# Altium schematic sheet [11] Power Input and Regualtor.SchDoc
size A; DocumentNumber: 11; SheetNumber: 11; SheetTotal: 11
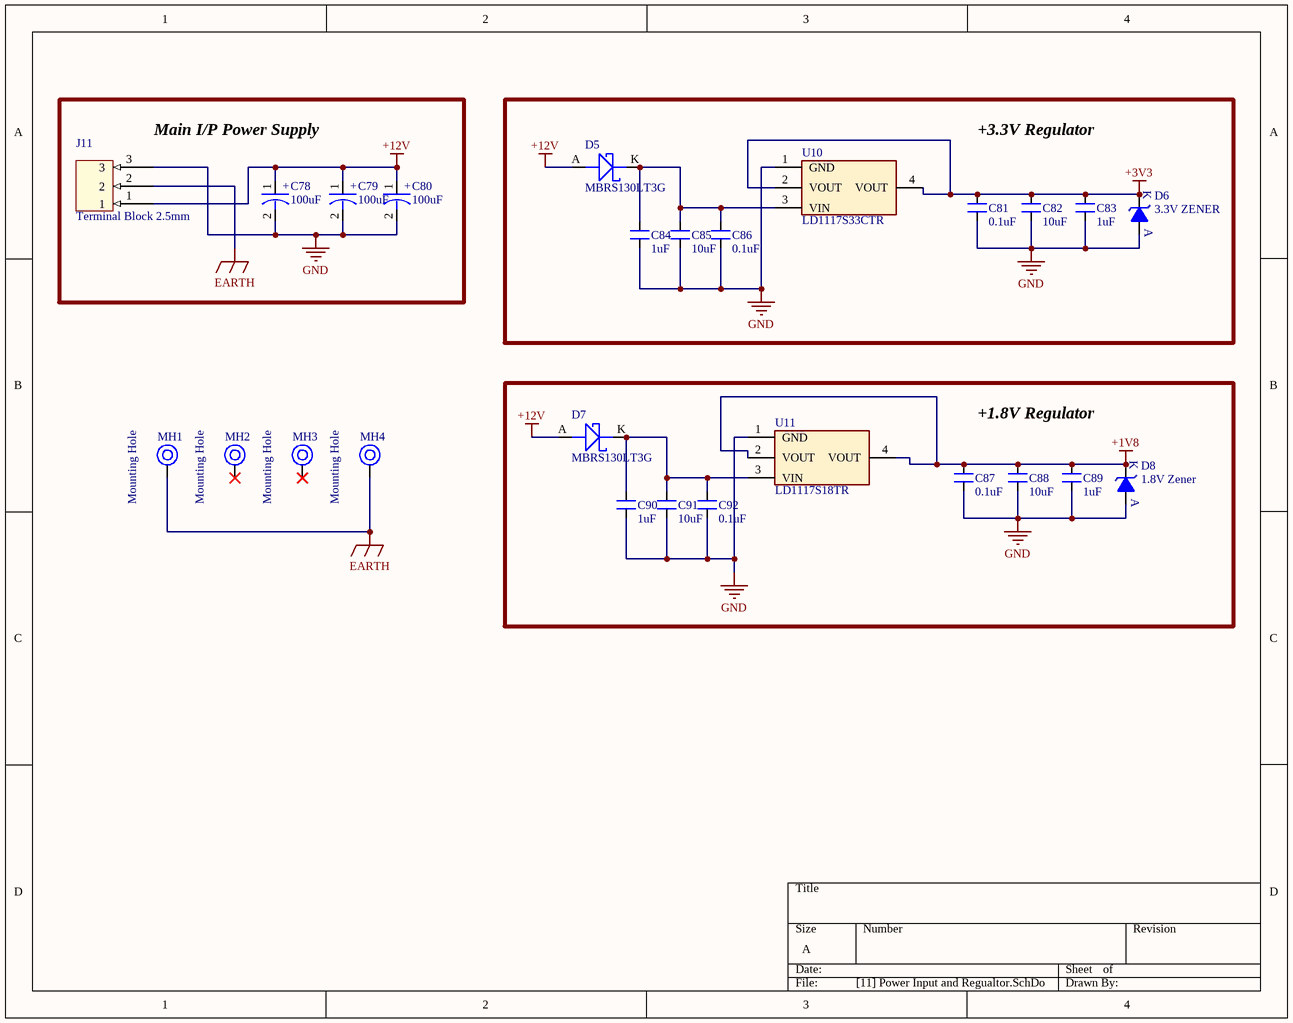
[diagram p0: [11] Power Input and Regualtor.SchDoc]

## Parts
C78  100uF  [ACAP_P305_D393_H393_RAD]
C79  100uF  [ACAP_P305_D393_H393_RAD]
C80  100uF  [ACAP_P305_D393_H393_RAD]
C81  0.1uF  [CAP_0805]
C82  10uF  [CAP_1206]
C83  1uF  [CAP_0805]
C84  1uF  [CAP_0805]
C85  10uF  [CAP_1206]
C86  0.1uF  [CAP_0805]
C87  0.1uF  [CAP_0805]
C88  10uF  [CAP_1206]
C89  1uF  [CAP_0805]
C90  1uF  [CAP_0805]
C91  10uF  [CAP_1206]
C92  0.1uF  [CAP_0805]
D5  MBRS130LT3G  [DIO_SMB_DO-214AA]
D6  3.3V ZENER  [DIO_SOD80C]
D7  MBRS130LT3G  [DIO_SMB_DO-214AA]
D8  1.8V Zener  [DIO_DO-213AB_SMD]
J11  Terminal Block 2.5mm  [CON3_100_TB_TH_ST]
MH1  Mounting Hole  [MOUNTING]
MH2  Mounting Hole  [MOUNTING]
MH3  Mounting Hole  [MOUNTING]
MH4  Mounting Hole  [MOUNTING]
U10  LD1117S33CTR  [SOT223_3]
U11  LD1117S18TR  [SOT223_3]

## Blocks framed on the sheet
Main I/P Power Supply: C78-C80 J11
+3.3V Regulator: C81-C86 D5 D6 U10
+1.8V Regulator: C87-C92 D7 D8 U11

## Nets
+1V8: C87.2 C88.1 C89.2 D8.K U11.2(VOUT) U11.4(VOUT)
+3V3: C81.2 C82.1 C83.2 D6.K U10.2(VOUT) U10.4(VOUT)
+12V: C78.1 C79.1 C80.1 D5.A D7.A J11.1
EARTH: J11.2 MH1.1 MH4.1
GND: C78.2 C79.2 C80.2 C81.1 C82.2 C83.1 C84.1 C85.2 C86.1 C87.1 C88.2 C89.1 C90.1 C91.2 C92.1 D6.A D8.A J11.3 U10.1(GND) U11.1(GND)
NetC84_2: C84.2 C85.1 C86.2 D5.K U10.3(VIN)
NetC90_2: C90.2 C91.1 C92.2 D7.K U11.3(VIN)

Not connected (* = marked no-connect by the designer): MH2 1*; MH3 1*

## Notes on the sheet
- (in symbol CAP-P_100uF-50V-20%-RAD) +

## Library data of the parts
C78-C80 = CAP-P_100uF-50V-20%-RAD: 100µF 50V Aluminum Polymer Capacitor Radial, Can - SMD 28mOhm 4000 Hrs @ 125°C; Manufacturer: Nichicon; Manufacturer Part Number: GYA1H101MCQ1GS; Alternate Part Number-1: VEU101M1HTR-1010; Case/Package: Radial-SMD; Supplier-1: SP ROAD; Supplier Part Number-1: GYA1H101MCQ1GS
C81 C86 C87 C92 = CAP_0.1uF-50V-10%-0805: 0.1µF ±10% 50V Ceramic Capacitor X7R 0805 (2012 Metric); Manufacturer: Samsung; Manufacturer Part Number: CL21B104KBCNNNC; Alternate Part Number-1: NA; Case/Package: 0805; Supplier-1: SIRICOM; Supplier Part Number-1: 0805B104K500CT
C82 C85 C88 C91 = CAP_10uF-50V-10%-1206: 10µF ±10% 50V Ceramic Capacitor X7R 1206 (3216 Metric); Manufacturer: KEMET; Manufacturer Part Number: CL31B106KBHNNNE; Alternate Part Number-1: GRT31CR61H106ME01L; Case/Package: 1206; Supplier-1: SIRICOM; Supplier Part Number-1: CC1206KKX5R9BB106
C83 C84 C89 C90 = CAP_1uF-50V-5%-0805: 1µF ±5% 50V Ceramic Capacitor X7R 0805 (2012 Metric); Manufacturer: Samsung; Manufacturer Part Number: CC0805JKX7R9BB105; Alternate Part Number-1: 0805F105M500NT; Case/Package: 0805; Supplier-1: SIRICOM; Supplier Part Number-1: CL21B105KBFNNNE
D5 D7 = DIO-S_445mV-30V-2A-SMB: Diode Schottky 30V 2A Surface Mount SMB; Manufacturer: ON Semiconductor; Alternate Part Number-1: NA; Manufacturer Part Number: MBRS130LT3G; Case/Package: SMB; Supplier-1: ARROW; Supplier Part Number-1: MBRS130LT3G
D6 = DIO-Z_3.3V-500mW-SOD-80: Zener Diode 3.3V 500mW ±5% Surface Mount LLDS; MiniMelf; Manufacturer: Vishay Semiconductors; Manufacturer Part Number: BZV55-C3V3,135; Alternate Part Number-1: TZM5226B-GS08; Case/Package: SOD-80; Supplier-1: SIRICOM; Supplier Part Number-1: BZV55-C3V3
D8 = DIO-Z_1.8V-500mW-DO213AA: Zener Diode 1.8V 500mW ±5% Surface Mount DO-213AA; Manufacturer: *; Manufacturer Part Number: *; Case/Package: *; Supplier-1: *; Supplier Part Number-1: *; Alternate Part Number-1: *
J11 = CON-TB_3X1-100-ST-TH: 3 Pins, 1 Row 2.54mm Pitch, straight Connector, male; Manufacturer Part Number: 1725669; Manufacturer: Phoenix Contact; Alternate Part Number-1: NA; Case/Package: TH-CON; Supplier-1: SP ROAD; Supplier Part Number-1: 1725669
MH1-MH4 = MH_3.5H_6D: Manufacturer Part Number: NA; Case/Package: TH; Manufacturer: NA; Supplier-1: NA; Supplier Part Number-1: NA; Alternate Part Number-1: NA
U10 = REG_15V-3.3V-0.9A-12W-SOT223: Linear Voltage Regulator IC 1 Output 800mA SOT-223; Manufacturer: STMicroelectronics; Alternate Part Number-1: NA; Manufacturer Part Number: LD1117S33CTR; Case/Package: SOT223; Supplier-1: SP ROAD; Supplier Part Number-1: LD1117S33CTR
U11 = REG_15V-1.8V-0.8A-1.4W-SOT223: LDO Voltage Regulators 1.8V 0.8A Positive; Manufacturer: STMicroelectronics; Alternate Part Number-1: NA; Manufacturer Part Number: LD1117S18TR; Case/Package: SOT-223-3; Supplier-1: Mouser; Supplier Part Number-1: 511-LD1117S18-TR